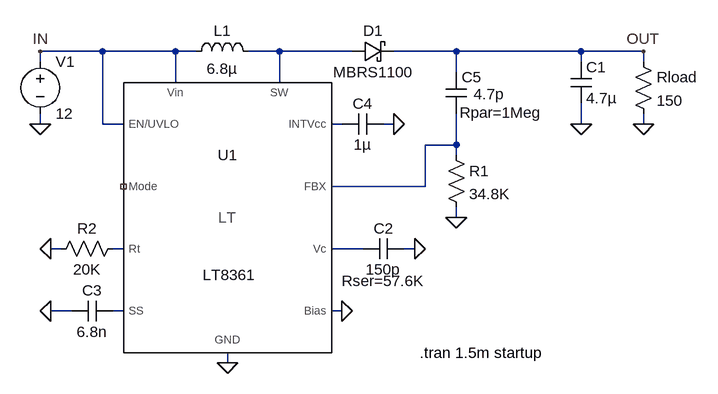
[diagram p0: schematic 8361.asc]
8361.asc, the LTspice schematic file:
Version 4
SHEET 1 1060 680
WIRE 32 -32 -64 -32
WIRE 144 -32 32 -32
WIRE 176 -32 144 -32
WIRE 304 -32 256 -32
WIRE 416 -32 304 -32
WIRE 576 -32 480 -32
WIRE 768 -32 576 -32
WIRE 864 -32 768 -32
WIRE -64 -16 -64 -32
WIRE 768 -16 768 -32
WIRE 864 -16 864 -32
WIRE 576 0 576 -32
WIRE 144 16 144 -32
WIRE 304 16 304 -32
WIRE -64 80 -64 64
WIRE 32 80 32 -32
WIRE 64 80 32 80
WIRE 400 80 384 80
WIRE 480 80 464 80
WIRE 768 80 768 48
WIRE 864 80 864 64
WIRE 576 112 576 64
WIRE 576 112 528 112
WIRE 576 128 576 112
WIRE 528 176 528 112
WIRE 528 176 384 176
WIRE 576 224 576 208
WIRE -32 272 -48 272
WIRE 64 272 48 272
WIRE 432 272 384 272
WIRE 512 272 496 272
WIRE -16 368 -48 368
WIRE 64 368 48 368
WIRE 400 368 384 368
WIRE 224 448 224 432
FLAG -64 80 0
FLAG 864 80 0
FLAG 768 80 0
FLAG 400 368 0
FLAG 224 448 0
FLAG -48 272 0
FLAG -48 368 0
FLAG 512 272 0
FLAG 576 224 0
FLAG 864 -32 OUT
FLAG -64 -32 IN
FLAG 480 80 0
SYMBOL voltage -64 -32 R0
SYMATTR InstName V1
SYMATTR Value 12
SYMBOL ind 160 -16 R270
WINDOW 0 32 56 VTop 2
WINDOW 3 5 56 VBottom 2
SYMATTR InstName L1
SYMATTR Value 6.8µ
SYMATTR SpiceLine Rser=.5
SYMBOL schottky 416 -16 R270
WINDOW 0 32 32 VTop 2
WINDOW 3 0 32 VBottom 2
SYMATTR InstName D1
SYMATTR Value MBRS1100
SYMATTR Description Diode
SYMATTR Type diode
SYMBOL cap 752 -16 R0
SYMATTR InstName C1
SYMATTR Value 4.7µ
SYMBOL res 560 112 R0
SYMATTR InstName R1
SYMATTR Value 34.8K
SYMBOL cap 432 288 R270
WINDOW 0 32 32 VTop 2
WINDOW 3 0 32 VBottom 2
WINDOW 123 -18 32 VBottom 2
SYMATTR InstName C2
SYMATTR Value 150p
SYMATTR Value2 Rser=57.6K
SYMBOL cap 48 352 R90
WINDOW 0 0 32 VBottom 2
WINDOW 3 32 32 VTop 2
SYMATTR InstName C3
SYMATTR Value 6.8n
SYMBOL res 64 256 R90
WINDOW 0 0 56 VBottom 2
WINDOW 3 32 56 VTop 2
SYMATTR InstName R2
SYMATTR Value 20K
SYMBOL cap 400 64 M90
WINDOW 0 0 32 VBottom 2
WINDOW 3 32 32 VTop 2
SYMATTR InstName C4
SYMATTR Value 1µ
SYMBOL cap 560 0 R0
WINDOW 123 21 62 Left 2
WINDOW 3 43 34 Left 2
SYMATTR Value2 Rpar=1Meg
SYMATTR Value 4.7p
SYMATTR InstName C5
SYMBOL res 848 -32 R0
SYMATTR InstName Rload
SYMATTR Value 150
SYMBOL PowerProducts\\LT8361 224 224 R0
SYMATTR InstName U1
TEXT 520 432 Left 2 !.tran 1.5m startup

The netlist it stands for:
* 8361.asc
V1 IN 0 12
L1 IN N001 6.8µ Rser=.5
D1 N001 OUT MBRS1100
C1 OUT 0 4.7µ
R1 N003 0 34.8K
C2 N005 0 150p Rser=57.6K
C3 N006 0 6.8n
R2 N004 0 20K
C4 N002 0 1µ
C5 OUT N003 4.7p Rpar=1Meg
Rload OUT 0 150
XU1 IN N005 IN N002 0 N003 N004 N006 NC_01 N001 0 LT8361  ; pins EN/UVLO Vc Vin INTVcc Bias FBX Rt SS Mode SW GND
.model D D
.lib standard.dio
.tran 1.5m startup
.lib LT8361.sub
.backanno
.end